# Altium project DPIAT202304_FRONTDOOR.PrjPcb
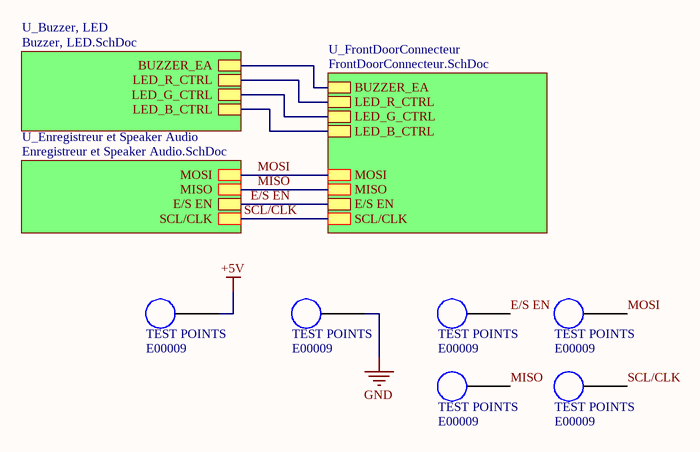
[diagram p0: Top-Sheet.SchDoc]
4 sheets, 53 parts. Net scope: hierarchical (ports join the sheet entries above them; power ports are global).
Board file: ADAM202303_FRONTDOOR.PcbDoc
Sheets:
  Top-Sheet.SchDoc
    U_FrontDoorConnecteur = FrontDoorConnecteur.SchDoc
    U_Buzzer, LED = Buzzer, LED.SchDoc
    U_Enregistreur et Speaker Audio = Enregistreur et Speaker Audio.SchDoc

## Sheet Top-Sheet.SchDoc
size Letter; Organization: Cegep Limoilou; Address1: 1300, 8e Avenue; Address2: Québec, QC; Address3: Canada; Address4: G1J 5L5; Revision: Enseignants; SheetNumber: 1; SheetTotal: 4; Conception: Ilyes Gharmoul; Titre: ADAM FRONT-DOOR SYST; Modification: Ilyes G

### Parts
T1  TEST POINTS  ADAM Inventory Number 1: E00009  [TEST POINTS]
T2  TEST POINTS  ADAM Inventory Number 1: E00009  [TEST POINTS]
T3  TEST POINTS  ADAM Inventory Number 1: E00009  [TEST POINTS]
T4  TEST POINTS  ADAM Inventory Number 1: E00009  [TEST POINTS]
T5  TEST POINTS  ADAM Inventory Number 1: E00009  [TEST POINTS]
T6  TEST POINTS  ADAM Inventory Number 1: E00009  [TEST POINTS]

### Sub-sheets
U_Buzzer, LED = Buzzer, LED.SchDoc: BUZZER_EA, LED_R_CTRL, LED_G_CTRL, LED_B_CTRL
U_Enregistreur et Speaker Audio = Enregistreur et Speaker Audio.SchDoc: MOSI, MISO, SCL/CLK, E/S EN
U_FrontDoorConnecteur = FrontDoorConnecteur.SchDoc: BUZZER_EA, LED_R_CTRL, LED_G_CTRL, LED_B_CTRL, MOSI, MISO, E/S EN, SCL/CLK

### Nets
+5V: T1.1
GND: T2.1
E/S EN: T3.1 ; sheet U_FrontDoorConnecteur/E/S EN, sheet U_Enregistreur et Speaker Audio/E/S EN
LED_B_CTRL: sheet U_FrontDoorConnecteur/LED_B_CTRL, sheet U_Buzzer, LED/LED_B_CTRL
LED_G_CTRL: sheet U_FrontDoorConnecteur/LED_G_CTRL, sheet U_Buzzer, LED/LED_G_CTRL
LED_R_CTRL: sheet U_FrontDoorConnecteur/LED_R_CTRL, sheet U_Buzzer, LED/LED_R_CTRL
MISO: T5.1 ; sheet U_FrontDoorConnecteur/MISO, sheet U_Enregistreur et Speaker Audio/MISO
MOSI: T4.1 ; sheet U_FrontDoorConnecteur/MOSI, sheet U_Enregistreur et Speaker Audio/MOSI
SCL/CLK: T6.1 ; sheet U_FrontDoorConnecteur/SCL/CLK, sheet U_Enregistreur et Speaker Audio/SCL/CLK
NetJ1_8: sheet U_FrontDoorConnecteur/BUZZER_EA, sheet U_Buzzer, LED/BUZZER_EA

### Notes on the sheet
- Titre :
- Conception :
- Date :
- Modification :
- Heure :
- Révision :
- Feuille
- de
- Fichier :

### Library data of the parts
T1-T6 = TEST POINTS: RCWCTE TEST POINTS; Manufacturer Part Number 1: RCWCTE

## Sheet FrontDoorConnecteur.SchDoc
size Letter; Organization: Cegep Limoilou; Address1: 1300, 8e Avenue; Address2: Québec, QC; Address3: Canada; Address4: G1J 5L5; Revision: Enseignants; SheetNumber: 2; SheetTotal: 4; Conception: Ilyes Gharmoul; Titre: Connecteur FrontDoor; Modification: Ilyes G
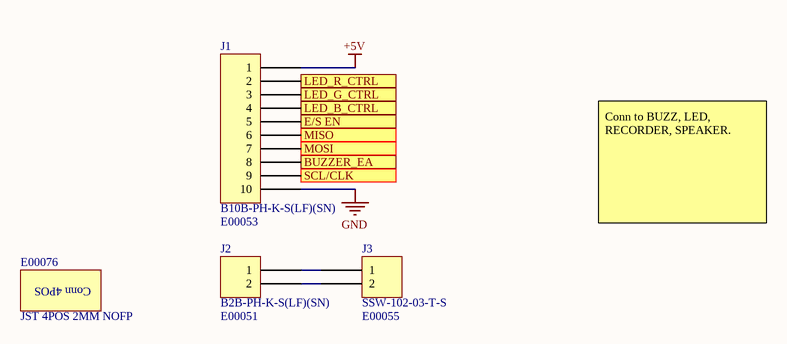
[diagram p1: FrontDoorConnecteur.SchDoc]

### Parts
H1  JST 4POS 2MM NOFP  ADAM Inventory Number 1: E00076
J1  B10B-PH-K-S(LF)(SN)  ADAM Inventory Number 1: E00053  [CONN JST 10PIN]
J2  B2B-PH-K-S(LF)(SN)  ADAM Inventory Number 1: E00051  [CONN JST 2PIN]
J3  SSW-102-03-T-S  ADAM Inventory Number 1: E00055  [CONN FEM HEADER 2PIN]

### Ports
BUZZER_EA, E/S EN, LED_B_CTRL, LED_G_CTRL, LED_R_CTRL, MISO, MOSI, SCL/CLK

### Nets
+5V: J1.1
GND: J1.10
E/S EN: J1.5 ; port E/S EN
LED_B_CTRL: J1.4 ; port LED_B_CTRL
LED_G_CTRL: J1.3 ; port LED_G_CTRL
LED_R_CTRL: J1.2 ; port LED_R_CTRL
MISO: J1.6 ; port MISO
MOSI: J1.7 ; port MOSI
SCL/CLK: J1.9 ; port SCL/CLK
NetJ1_8: J1.8 ; port BUZZER_EA
NetJ2_1: J2.1 J3.1
NetJ2_2: J2.2 J3.2

### Notes on the sheet
- Conn to BUZZ, LED, RECORDER, SPEAKER.
- Titre :
- Conception :
- Date :
- Modification :
- Heure :
- Révision :
- Feuille
- de
- Fichier :
- (in symbol CONN JST 4POS 2MM NOFP) Conn 4POS

### Library data of the parts
H1 = CONN JST 4POS 2MM NOFP: No footprint, for BOM; Manufacturer Part Number 1: 0022272041; Supplier 1: Mouser; Supplier Part Number 1: 538-22-27-2041
J1 = CONN JST 10POS TH: CONN HEADER VERT 10POS 2MM; Manufacturer: JST Sales America Inc.; Contact Length - Mating: 0.130" (3.30mm); Contact Length - Post: 0.134" (3.40mm); Current Rating (Amps): 2A; Material Flammability Rating: UL94 V-0; Number of Positions: 10; Number of Positions Loaded: All; Overall Contact Length: 0.333" (8.45mm); Pitch - Mating: 0.079" (2.00mm); Shrouding: Shrouded - 4 Wall; Style: Board to Cable/Wire; Voltage Rating: 100V; Manufacturer Part Number 1: B10B-PH-K-S(LF)(SN); ComponentLink1Description: Datasheet; ComponentLink1URL: http://www.jst-mfg.com/product/pdf/eng/ePH.pdf; ComponentLink2Description: DigiKey Link; ComponentLink2URL: http://digikey.com/product-detail/en/jst-sales-america-inc/B10B-PH-K-S-LF-SN/455-1712-ND/926619; Connector Type: Header; Contact Finish - Mating: Tin; Contact Finish - Post: Tin; Contact Material: Brass; Contact Shape: Square; Contact Type: Male Pin; Fastening Type: Detent Lock; Insulation Color: Natural; Insulation Height: 0.236" (6.00mm); Insulation Material: Polyamide (PA66), Nylon 6/6; LastUpdated: 2020-01-12 22:31:09; Lifecycle Status: Active; Minimum Order: 1; Mounting Type: Through Hole; Number of Rows: 1; Operating Temperature: -25°C ~ 85°C; Packaging: Bulk; PartId: 33; Part Status: Active; Price: 0.46; Series: PH; Supplier 1: DigiKey; Supplier Part Number 1: 455-1712-ND; Termination: Press-Fit, Solder
J2 = CONN JST 2PIN TH: CONN HEADER VERT 2POS 2MM; Manufacturer: JST Sales America Inc.; Contact Length - Mating: 0.130" (3.30mm); Contact Length - Post: 0.134" (3.40mm); Current Rating (Amps): 2A; Material Flammability Rating: UL94 V-0; Number of Positions: 2; Number of Positions Loaded: All; Overall Contact Length: 0.333" (8.45mm); Pitch - Mating: 0.079" (2.00mm); Shrouding: Shrouded - 4 Wall; Style: Board to Cable/Wire; Voltage Rating: 100V; Manufacturer Part Number 1: B2B-PH-K-S(LF)(SN); ComponentLink1Description: Datasheet; ComponentLink1URL: http://www.jst-mfg.com/product/pdf/eng/ePH.pdf; ComponentLink2Description: DigiKey Link; ComponentLink2URL: http://digikey.com/product-detail/en/jst-sales-america-inc/B2B-PH-K-S-LF-SN/455-1704-ND/926611; Connector Type: Header; Contact Finish - Mating: Tin; Contact Finish - Post: Tin; Contact Material: Brass; Contact Shape: Square; Contact Type: Male Pin; Fastening Type: Detent Lock; Insulation Color: Natural; Insulation Height: 0.236" (6.00mm); Insulation Material: Polyamide (PA66), Nylon 6/6; LastUpdated: 2020-01-03 23:40:58; Lifecycle Status: Active; Minimum Order: 1; Mounting Type: Through Hole; Number of Rows: 1; Operating Temperature: -25°C ~ 85°C; Packaging: Bulk; PartId: 11; Part Status: Active; Price: 0.17; Series: PH; Supplier 1: DigiKey; Supplier Part Number 1: 455-1704-ND; Termination: Press-Fit, Solder
J3 = CONN FEM HEADER 2POS: CONN RCPT 2POS 0.1 TIN; Manufacturer: Samtec Inc.; Connector Type: Receptacle; Current Rating (Amps): 5.7A per Contact; Material Flammability Rating: UL94 V-0; Number of Positions: 2; Number of Positions Loaded: All; Style: Board to Board or Cable; Manufacturer Part Number 1: SSW-102-03-T-S; ComponentLink2Description: DigiKey Link; ComponentLink2URL: http://digikey.com/product-detail/en/samtec-inc/SSW-102-03-T-S/SSW-102-03-T-S-ND/7873010; Contact Finish - Mating: Tin; Contact Finish - Post: Tin; Contact Type: Forked; Fastening Type: Push-Pull; Insulation Color: Black; LastUpdated: 2022-06-21 15:06:02; Lifecycle Status: Active; Minimum Order: 1; Mounting Type: Through Hole; Number of Rows: 1; Operating Temperature: -55°C ~ 105°C; Packaging: Bulk; Part Status: Active; Price: 0.53; Series: SSW; Supplier 1: DigiKey; Supplier Part Number 1: SSW-102-03-T-S-ND; Termination: Solder

## Sheet Buzzer, LED.SchDoc
size Letter; Organization: Cegep Limoilou; Address1: 1300, 8e Avenue; Address2: Québec, QC; Address3: Canada; Address4: G1J 5L5; Revision: Enseignants; SheetNumber: 3; SheetTotal: 4; Conception: Ilyes Gharmoul; Titre: Buzzer LED Conn; Modification: Ilyes G
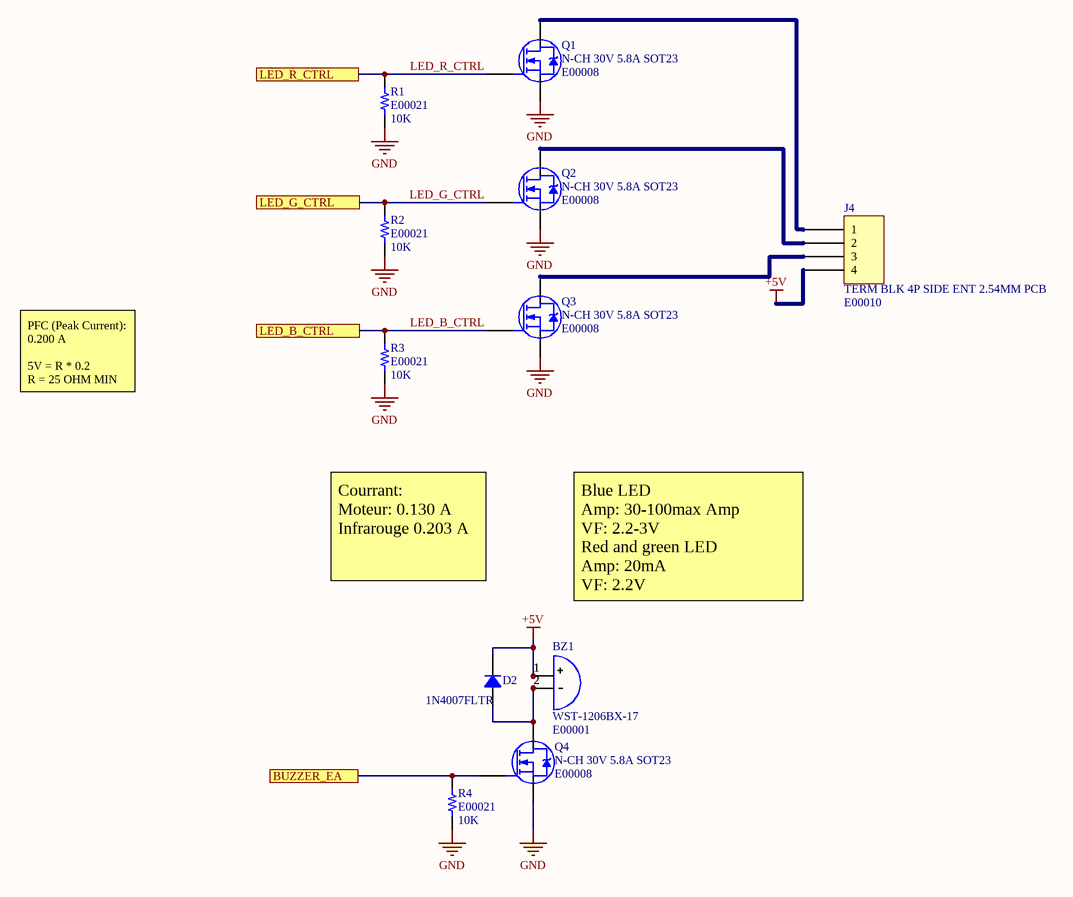
[diagram p2: Buzzer, LED.SchDoc]

### Parts
BZ1  WST-1206BX-17  ADAM Inventory Number 1: E00001  [BUZZ WST-1206BX]
D2  1N4007FLTR  [SOD123F]
J4  TERM BLK 4P SIDE ENT 2.54MM PCB  ADAM Inventory Number 1: E00010  [TERM BLOC 4P]
Q1  N-CH 30V 5.8A SOT23  ADAM Inventory Number 1: E00008  [N-CHANNEL TRANS]
Q2  N-CH 30V 5.8A SOT23  ADAM Inventory Number 1: E00008  [N-CHANNEL TRANS]
Q3  N-CH 30V 5.8A SOT23  ADAM Inventory Number 1: E00008  [N-CHANNEL TRANS]
Q4  N-CH 30V 5.8A SOT23  ADAM Inventory Number 1: E00008  [N-CHANNEL TRANS]
R1  ADAM Inventory Number 1: E00021  [RES 0603]  (hidden comment: 10K)
R2  ADAM Inventory Number 1: E00021  [RES 0603]  (hidden comment: 10K)
R3  ADAM Inventory Number 1: E00021  [RES 0603]  (hidden comment: 10K)
R4  ADAM Inventory Number 1: E00021  [RES 0603]  (hidden comment: 10K)

### Ports
BUZZER_EA, LED_B_CTRL, LED_G_CTRL, LED_R_CTRL

### Nets
+5V: BZ1.1 D2.2 J4.4
GND: Q1.2(S) Q2.2(S) Q3.2(S) Q4.2(S) R1.1 R2.1 R3.1 R4.1
LED_B_CTRL: Q3.1(G) R3.2 ; port LED_B_CTRL
LED_G_CTRL: Q2.1(G) R2.2 ; port LED_G_CTRL
LED_R_CTRL: Q1.1(G) R1.2 ; port LED_R_CTRL
NetBZ1_2: BZ1.2 D2.1 Q4.3(D)
NetJ1_8: Q4.1(G) R4.2 ; port BUZZER_EA
NetJ4_1: J4.1 Q1.3(D)
NetJ4_2: J4.2 Q2.3(D)
NetJ4_3: J4.3 Q3.3(D)

### Notes on the sheet
- PFC (Peak Current): 0.200 A
  5V = R * 0.2
  R = 25 OHM MIN
- Courrant:
  Moteur: 0.130 A
  Infrarouge 0.203 A
- Blue LED
  Amp: 30-100max Amp
  VF: 2.2-3V
  Red and green LED
  Amp: 20mA
  VF: 2.2V
- Titre :
- Conception :
- Date :
- Modification :
- Heure :
- Révision :
- Feuille
- de
- Fichier :

### Library data of the parts
BZ1 = WST-1206BX-17: Buzzers Indicator, Internally Driven Magnetic 5 V 30mA 3.1kHz 83dB @ 5V, 10cm Through Hole PC Pins; Supplier 1: Digi-Key; Manufacturer Part Number 1: WST-1206BX-17; Supplier Part Number 1: 433-1081-ND
D2 = 1N4007FLTR: STANDARD RECTIFIER 1000V SOD-123; Manufacturer: SMC Diode Solutions; Capacitance @ Vr, F: 15pF @ 4V, 1MHz; Current - Average Rectified (Io): 1A; Current - Reverse Leakage @ Vr: 5µA @ 1000V; Speed: Standard Recovery >500ns, > 200mA (Io); Voltage - Forward (Vf) (Max) @ If: 1.1V @ 1A; Manufacturer Part Number 1: 1N4007FLTR; ComponentLink1Description: Datasheet; ComponentLink1URL: http://www.smc-diodes.com/propdf/1N4001FL-1N4007FL%20N1646%20REV.A.pdf; ComponentLink2Description: DigiKey Link; ComponentLink2URL: http://digikey.com/product-detail/en/smc-diode-solutions/1N4007FLTR/1655-1N4007FLCT-ND/11657827; Diode Type: Standard; LastUpdated: 2020-08-30 20:59:55; Lifecycle Status: Active; Minimum Order: 1; Mounting Type: Surface Mount; Package / Case: SOD-123F; Packaging: TapeAndReel; PartId: 3314; Price: 0.01; Supplier 1: DigiKey; Supplier Part Number 1: 1655-1N4007FLCT-ND; Supplier Device Package: SOD-123FL; Voltage - DC Reverse (Vr) (Max): 1000V
J4 = TERM BLK 4P SIDE ENT 2.54MM PCB: Manufacturer Part Number 1: 282834-4; Manufacturer: TE Connectivity AMP Connectors; Current: 10A; Mating Orientation: Horizontal with Board; Number of Levels: 1; Pitch: 0.100" (2.54mm); Positions Per Level: 4; Voltage: 150V; Wire Gauge: 16-30 AWG; Wire Termination: Screw - Rising Cage Clamp; Color: Green; ComponentLink1Description: Datasheet; ComponentLink1URL: https://www.te.com/commerce/DocumentDelivery/DDEController?Action=srchrtrv&DocNm=282834&DocType=Customer+Drawing&DocLang=English; ComponentLink2Description: DigiKey Link; ComponentLink2URL: http://digikey.com/product-detail/en/te-connectivity-amp-connectors/282834-4/A98335-ND/1153265; LastUpdated: 2020-01-15 04:16:05; Lifecycle Status: Active; Minimum Order: 1; Mounting Type: Through Hole; Packaging: Bulk; Part Status: Active; Price: 2.68; Series: Buchanan; Supplier 1: DigiKey; Supplier Part Number 1: A98335-ND
Q1-Q4 = TRANS N-CHANNEL 30V 5.8A SOT23: N-Channel 5.8A (Tj) 350mW Surface Mount SOT-23; Manufacturer: MCC; Manufacturer Part Number 1: SI3404-TP; Source: IC_Component.SchLib; Design Item ID: TRANS N-CHANNEL 30V 5.8A SOT23; Component Type: Transistors; Supplier 1: Digi-Key; Supplier Part Number 1: DMN3051LDICT-ND
R1-R4 = RES SMD 10K OHM: RES SMD 10K OHM 1% 1/10W 0603; Manufacturer Part Number 1: RC0603FR-0710KL; Manufacturer: Rohm Semiconductor; Power (Watts): 0.25W, 1/4W; Temperature Coefficient: ±100ppm/°C; ComponentLink1Description: Datasheet; ComponentLink1URL: https://www.rohm.com/datasheet/ESR01MZPF/esr-e; ComponentLink2Description: DigiKey Link; ComponentLink2URL: https://www.digikey.com/en/products/detail/rohm-semiconductor/ESR03EZPF1002/1983429; Composition: Thick Film; Device Package: 0603 (1608 Metric); Features: Automotive AEC-Q200, Pulse Withstanding; Height - Seated (Max): 0.022" (0.55mm); LastUpdated: 2023-03-27 19:26:49; Lifecycle Status: Active; Minimum Order: 1; Number of Terminations: 2; Operating Temperature: -55°C ~ 155°C; Package / Case: 0603 (1608 Metric); Packaging: TapeAndReel; PartId: 5466; Part Status: Active; Price: 0.02; Ratings: AEC-Q200; Resistance: 10K; Series: ESR; Size / Dimension: 0.063" L x 0.031" W (1.60mm x 0.80mm); Supplier Device Package: 0603; Tolerance: ±1%; Supplier 1: Future Electronics; Supplier Part Number 1: 3349388; Value: 10K

## Sheet Enregistreur et Speaker Audio.SchDoc
size Letter; Organization: Cegep Limoilou; Address1: 1300, 8e Avenue; Address2: Québec, QC; Address3: Canada; Address4: G1J 5L5; Revision: Enseignants; SheetNumber: 4; SheetTotal: 4; Conception: Ilyes Gharmoul; Titre: Enregistreur et Speaker; Modification: Ilyes G
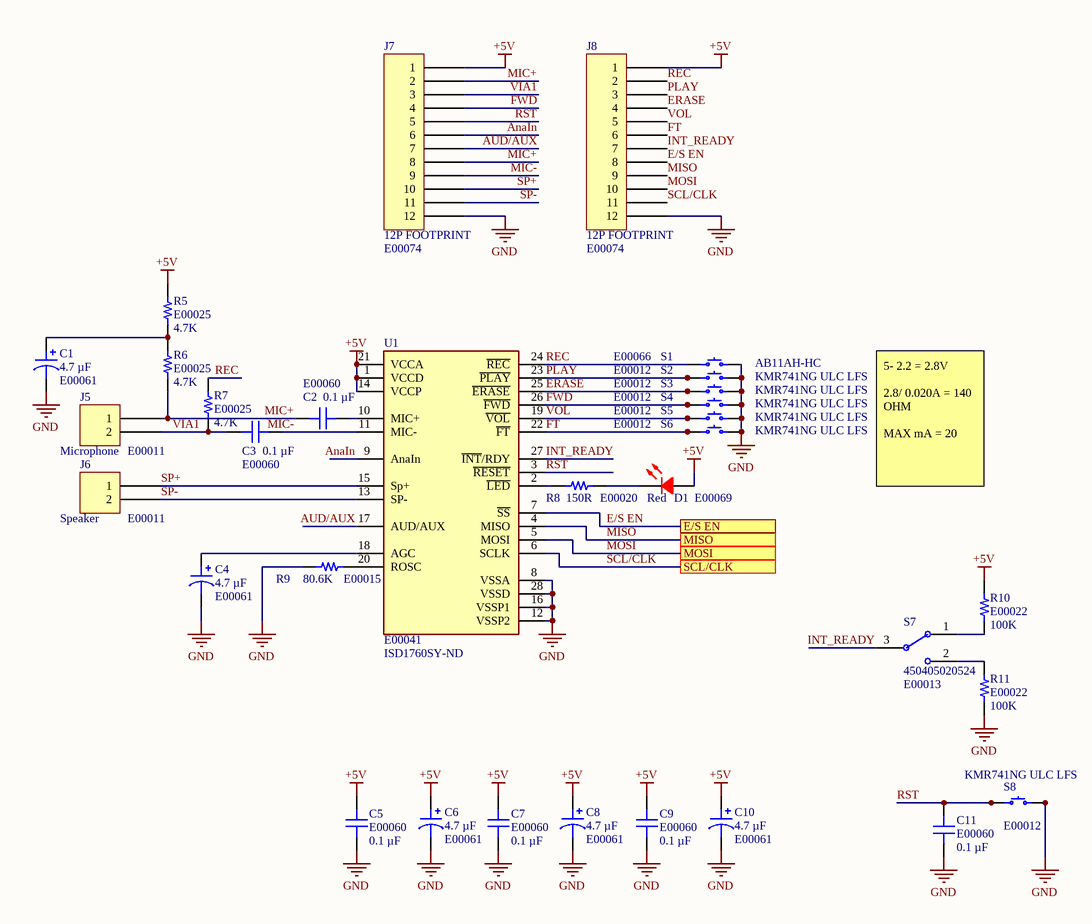
[diagram p3: Enregistreur et Speaker Audio.SchDoc]

### Parts
C1  4.7 µF  ADAM Inventory Number 1: E00061  [CAP ALUM 4.3MM2]
C2  ADAM Inventory Number 1: E00060  [CAP 0603]  (hidden comment: 0.1 µF)
C3  ADAM Inventory Number 1: E00060  [CAP 0603]  (hidden comment: 0.1 µF)
C4  4.7 µF  ADAM Inventory Number 1: E00061  [CAP ALUM 4.3MM2]
C5  ADAM Inventory Number 1: E00060  [CAP 0603]  (hidden comment: 0.1 µF)
C6  4.7 µF  ADAM Inventory Number 1: E00061  [CAP ALUM 4.3MM2]
C7  ADAM Inventory Number 1: E00060  [CAP 0603]  (hidden comment: 0.1 µF)
C8  4.7 µF  ADAM Inventory Number 1: E00061  [CAP ALUM 4.3MM2]
C9  ADAM Inventory Number 1: E00060  [CAP 0603]  (hidden comment: 0.1 µF)
C10  4.7 µF  ADAM Inventory Number 1: E00061  [CAP ALUM 4.3MM2]
C11  ADAM Inventory Number 1: E00060  [CAP 0603]  (hidden comment: 0.1 µF)
D1  Red  ADAM Inventory Number 1: E00069  [Red Led 0603]
J5  Microphone  ADAM Inventory Number 1: E00011  [TERM BLOC 2P]
J6  Speaker  ADAM Inventory Number 1: E00011  [TERM BLOC 2P]
J7  12P FOOTPRINT  ADAM Inventory Number 1: E00074  [CONN 12PIN FEMALE]
J8  12P FOOTPRINT  ADAM Inventory Number 1: E00074  [CONN 12PIN FEMALE]
R5  ADAM Inventory Number 1: E00025  [RES 0603]  (hidden comment: 4.7K)
R6  ADAM Inventory Number 1: E00025  [RES 0603]  (hidden comment: 4.7K)
R7  ADAM Inventory Number 1: E00025  [RES 0603]  (hidden comment: 4.7K)
R8  ADAM Inventory Number 1: E00020  [RES 0603]  (hidden comment: 150R)
R9  ADAM Inventory Number 1: E00015  [RES 0603]  (hidden comment: 80.6K)
R10  ADAM Inventory Number 1: E00022  [RES 0603]  (hidden comment: 100K)
R11  ADAM Inventory Number 1: E00022  [RES 0603]  (hidden comment: 100K)
S1  AB11AH-HC  ADAM Inventory Number 1: E00066  [BUTTON AB11AH-HC]
S2  KMR741NG ULC LFS  ADAM Inventory Number 1: E00012  [Switch Lin SMD]
S3  KMR741NG ULC LFS  ADAM Inventory Number 1: E00012  [Switch Lin SMD]
S4  KMR741NG ULC LFS  ADAM Inventory Number 1: E00012  [Switch Lin SMD]
S5  KMR741NG ULC LFS  ADAM Inventory Number 1: E00012  [Switch Lin SMD]
S6  KMR741NG ULC LFS  ADAM Inventory Number 1: E00012  [Switch Lin SMD]
S7  450405020524  ADAM Inventory Number 1: E00013  [SL 3Pos Switch]
S8  KMR741NG ULC LFS  ADAM Inventory Number 1: E00012  [Switch Lin SMD]
U1  ADAM Inventory Number 1: E00041  Supplier Part Number 1: ISD1760SY-ND  [ISD1760SY]  (hidden comment: ISD1760SY)

### Ports
E/S EN, MISO, MOSI, SCL/CLK

### Nets
+5V: C5.2 C6.1 C7.2 C8.1 C9.2 C10.1 D1.1 J7.1 J8.1 R5.2 R10.2 U1.1(VCCD) U1.14(VCCP) U1.21(VCCA)
GND: C1.2 C4.2 C5.1 C6.2 C7.1 C8.2 C9.1 C10.2 C11.1 J7.12 J8.12 R9.1 R11.1 S1.2 S2.3 S2.4 S3.3 S3.4 S4.3 S4.4 S5.3 S5.4 S6.3 S6.4 S8.3 S8.4 U1.8(VSSA) U1.12(VSSP2) U1.16(VSSP1) U1.28(VSSD)
AnaIn: J7.6 U1.9(AnaIn)
AUD/AUX: J7.7 U1.17(AUD/AUX)
E/S EN: J8.8 U1.7(~{SS}) ; port E/S EN
ERASE: J8.4 S3.1 S3.2 U1.25(~{ERASE})
FT: J8.6 S6.1 S6.2 U1.22(~{FT})
FWD: J7.4 S4.1 S4.2 U1.26(~{FWD})
INT_READY: J8.7 S7.3(COM) U1.27(~{INT}/RDY)
MIC+: C2.2 J5.1 J7.2 J7.8 R6.1
MIC-: C3.1 J7.9 U1.11(MIC-)
MISO: J8.9 U1.4(MISO) ; port MISO
MOSI: J8.10 U1.5(MOSI) ; port MOSI
PLAY: J8.3 S2.1 S2.2 U1.23(~{PLAY})
REC: J8.2 R7.2 S1.1 U1.24(~{REC})
RST: C11.2 J7.5 S8.1 S8.2 U1.3(~{RESET})
SCL/CLK: J8.11 U1.6(SCLK) ; port SCL/CLK
SP+: J6.1 J7.10 U1.15(Sp+)
SP-: J6.2 J7.11 U1.13(SP-)
VIA1: C3.2 J5.2 J7.3 R7.1
VOL: J8.5 S5.1 S5.2 U1.19(~{VOL})
NetC1_1: C1.1 R5.1 R6.2
NetC2_1: C2.1 U1.10(MIC+)
NetC4_1: C4.1 U1.18(AGC)
NetD1_2: D1.2 R8.2
NetR8_1: R8.1 U1.2(~{LED})
NetR9_2: R9.2 U1.20(ROSC)
NetR10_1: R10.1 S7.1
NetR11_2: R11.2 S7.2

### Notes on the sheet
- 5- 2.2 = 2.8V
  2.8/ 0.020A = 140 OHM
  MAX mA = 20
- Titre :
- Conception :
- Date :
- Modification :
- Heure :
- Révision :
- Feuille
- de
- Fichier :

### Library data of the parts
C1 C4 C6 C8 C10 = CAP ALUM 4.7UF 20% 35V: CAP ALUM 4.7UF 20% 35V SMD; manufacturer: United Chemi-Con; Manufacturer Part Number 1: EMVE350ADA4R7MD55G; Lifetime @ Temp.: 1000 Hrs @ 105°C; Polarization: Polar; Ripple Current @ Low Frequency: 16 mA @ 120 Hz; Surface Mount Land Size: 0.169" L x 0.169" W (4.30mm x 4.30mm); Applications: General Purpose; Capacitance: 4.7 µF; componentlink1description: Datasheet; componentlink1url: //media.digikey.com/pdf/Data%20Sheets/United%20Chemi-Con%20PDFs/MVE%20Series.pdf; componentlink2description: DigiKey Link; componentlink2url: https://www.digikey.com/en/products/detail/united-chemi-con/EMVE350ADA4R7MD55G/756875; Device Package: Radial, Can - SMD; Height - Seated (Max): 0.205" (5.20mm); lastupdated: 2023-04-04 19:53:03; Lifecycle Status: Active; Minimum Order: 1; Mounting Type: Surface Mount; Operating Temperature: -40°C ~ 105°C; Package / Case: Radial, Can - SMD; packaging: TapeAndReel; partid: 7039; Part Status: Active; price: 0.06; series: Alchip™- MVE; Size / Dimension: 0.157" Dia (4.00mm); Tolerance: ±20%; Voltage - Rated: 35 V; Supplier 1: Mouser; Supplier Part Number 1: 661-EMVE350ADA4R7MD5; value: 4.7 µF
C2 C3 C5 C7 C9 C11 = CAP CER 0.1UF 50V X7R 0603: Manufacturer Part Number 1: C0603C104K5RAC7411; manufacturer: KEMET; Tolerance: ±10%; Applications: Bypass, Decoupling; Capacitance: 0.1 µF; componentlink1description: Datasheet; componentlink1url: https://api.kemet.com/component-edge/download/datasheet/C0603C104K5RAC7411.pdf; componentlink2description: DigiKey Link; componentlink2url: https://www.digikey.com/en/products/detail/kemet/C0603C104K5RAC7411/3317013; Device Package: 0603 (1608 Metric); lastupdated: 2023-03-28 19:09:05; Lifecycle Status: Active; Minimum Order: 1; Mounting Type: Surface Mount, MLCC; Operating Temperature: -55°C ~ 125°C; Package / Case: 0603 (1608 Metric); packaging: TapeAndReel; partid: 2233; Part Status: Active; price: 0.01; series: SMD Comm X7R; Size / Dimension: 0.063" L x 0.031" W (1.60mm x 0.80mm); Supplier 1: DigiKey; Supplier Part Number 1: 399-C0603C104K5RAC7411CT-ND; Temperature Coefficient: X7R; Thickness (Max): 0.035" (0.90mm); Voltage - Rated: 50V; Value: 0.1 µF
D1 = 0603 RED LED: Manufacturer Part Number 1: BL-HUB36A-AV-TRB; Manufacturer: American Bright Optoelectronics Corporation; Configuration: Standard; Current - Test: 20mA; Lens Color: Colorless; Lens Style: Rectangle with Flat Top; Lens Transparency: Clear; Millicandela Rating: 94mcd; Viewing Angle: 120°; Voltage - Forward (Vf) (Typ): 2.2V; Wavelength - Dominant: 632nm; Wavelength - Peak: 645nm; Color: Red; ComponentLink1Description: Datasheet; ComponentLink1URL: https://americanbrightled.com/pdffiles/smt/BL-HUB36A-AV-TRB.pdf; ComponentLink2Description: DigiKey Link; ComponentLink2URL: https://www.digikey.com/en/products/detail/american-bright-optoelectronics-corporation/BL-HUB36A-AV-TRB/9678174; Device Package: 0603 (1608 Metric); Height (Max): 0.70mm; LastUpdated: 2023-03-27 19:53:19; Lifecycle Status: Active; Minimum Order: 1; Mounting Type: Surface Mount; Package / Case: 0603 (1608 Metric); Packaging: TapeAndReel; PartId: 1020; Part Status: Active; Price: 0.04; Series: -; Size / Dimension: 1.60mm L x 0.80mm W; Supplier 1: DigiKey; Supplier Part Number 1: BL-HUB36A-AV-TRBCT-ND; Supplier Device Package: 0603; Value: Red
J5 J6 = TERM BLK 2P SIDE ENT 2.54MM PCB: Manufacturer Part Number 1: 282834-2; Manufacturer: TE Connectivity AMP Connectors; Current: 10A; Mating Orientation: Horizontal with Board; Number of Levels: 1; Pitch: 0.100" (2.54mm); Positions Per Level: 2; Voltage: 150V; Wire Gauge: 16-30 AWG; Wire Termination: Screw - Rising Cage Clamp; Color: Green; ComponentLink1Description: Datasheet; ComponentLink1URL: https://www.te.com/commerce/DocumentDelivery/DDEController?Action=srchrtrv&DocNm=282834&DocType=Customer+Drawing&DocLang=English; ComponentLink2Description: DigiKey Link; ComponentLink2URL: http://digikey.com/product-detail/en/te-connectivity-amp-connectors/282834-2/A98333-ND/1150135; LastUpdated: 2020-01-15 04:15:38; Lifecycle Status: Active; Minimum Order: 1; Mounting Type: Through Hole; Packaging: Bulk; Part Status: Active; Price: 0.88; Series: Buchanan; Supplier 1: DigiKey; Supplier Part Number 1: A98333-ND
J7 J8 = 12P FOOTPRINT: FOOTPRINT FOR TEST OR JUST IN CASE; Manufacturer: Harwin Inc.; Manufacturer Part Number 1: PPTC121LFBN-RC; Connector Type: Receptacle; Current Rating (Amps): 3A; Mated Stacking Heights: 11.04mm, 12.63mm; Material Flammability Rating: UL94 V-0; Number of Positions: 12; Number of Positions Loaded: All; Style: Board to Board or Cable; ComponentLink1Description: Datasheet; ComponentLink1URL: https://cdn.harwin.com/pdfs/C001XX_M20_Series_Connectors.pdf; ComponentLink2Description: DigiKey Link; ComponentLink2URL: http://digikey.com/product-detail/en/harwin-inc/M20-7821242/952-1852-ND/3727819; Contact Finish - Mating: Gold; Contact Finish - Post: Tin; Contact Finish Thickness - Mating: Flash; Contact Type: Female Socket; Fastening Type: Push-Pull; Insulation Color: Black; LastUpdated: 2022-09-21 18:59:31; Lifecycle Status: Active; Minimum Order: 5004; Mounting Type: Through Hole; Number of Rows: 1; Operating Temperature: -40°C ~ 105°C; Packaging: Tube; Part Status: Active; Price: 0.74; Series: M20; Termination: Solder; Supplier 1: Digi-Key; Supplier Part Number 1: S6100-ND
R5-R7 = RES SMD 4.7K OHM: RES 4.7K OHM 1% 1/10W 0603; Manufacturer Part Number 1: RC0603FR-074K7L; Manufacturer: Stackpole Electronics Inc; Power (Watts): 0.1W, 1/10W; Temperature Coefficient: ±100ppm/°C; ComponentLink1Description: Datasheet; ComponentLink1URL: https://www.seielect.com/catalog/sei-rmcf_rmcp.pdf; ComponentLink2Description: DigiKey Link; ComponentLink2URL: https://www.digikey.com/en/products/detail/stackpole-electronics-inc/RMCF0603FT4K70/1760998; Composition: Thick Film; Device Package: 0603 (1608 Metric); Features: Automotive AEC-Q200; Height - Seated (Max): 0.022" (0.55mm); LastUpdated: 2023-04-04 19:29:43; Lifecycle Status: Active; Minimum Order: 1; Number of Terminations: 2; Operating Temperature: -55°C ~ 155°C; Package / Case: 0603 (1608 Metric); Packaging: CutTape; PartId: 6078; Part Status: Active; Price: 0.01; Ratings: AEC-Q200; Resistance: 4.7K; Series: RMCF; Size / Dimension: 0.061" L x 0.031" W (1.55mm x 0.80mm); Supplier Device Package: 0603; Tolerance: ±1%; Supplier 1: Digi-Key; Supplier Part Number 1: 311-4.70KHRCT-ND; Value: 4.7K
R8 = RES SMD 150 OHM: RES SMD 150 OHM 0.1% 1/8W 0603; Manufacturer Part Number 1: RC0603FR-07150RL; Manufacturer: Vishay Beyschlag; Power (Watts): 0.125W, 1/8W; Temperature Coefficient: ±25ppm/°C; ComponentLink1Description: Datasheet; ComponentLink1URL: http://www.vishay.com/docs/28785/mcat_pre.pdf; ComponentLink2Description: DigiKey Link; ComponentLink2URL: http://digikey.com/product-detail/en/vishay-beyschlag/MCT0603MD1500BP100/MCT0603-150-MBCT-ND/2092134; Composition: Thin Film; Device Package: 0603 (1608 Metric); Features: Anti-Sulfur, Automotive AEC-Q200; Height - Seated (Max): 0.022" (0.55mm); LastUpdated: 2023-04-04 19:29:46; Lifecycle Status: Active; Minimum Order: 1; Number of Terminations: 2; Operating Temperature: -55°C ~ 155°C; Package / Case: 0603 (1608 Metric); Packaging: TapeAndReel; PartId: 5246; Part Status: Active; Price: 0.23; Ratings: AEC-Q200; Resistance: 150R; Series: MCT AT - Precision; Size / Dimension: 0.061" L x 0.033" W (1.55mm x 0.85mm); Supplier Device Package: 0603; Tolerance: ±0.1%; Supplier 1: Future Electronics; Supplier Part Number 1: 1201284; Value: 150R
R9 = RES SMD 80.6K OHM: RES SMD 80.6K OHM 1% 1/4W 0603; Manufacturer Part Number 1: ERJ-3EKF8062V; Manufacturer: Vishay Dale; Power (Watts): 0.25W, 1/4W; Temperature Coefficient: ±100ppm/°C; ComponentLink1Description: Datasheet; ComponentLink1URL: https://www.vishay.com/docs/20065/rcse3.pdf; ComponentLink2Description: DigiKey Link; ComponentLink2URL: https://www.digikey.com/en/products/detail/vishay-dale/RCS060380K6FKEA/5868691; Composition: Thick Film; Device Package: 0603 (1608 Metric); Features: Automotive AEC-Q200, Pulse Withstanding; Height - Seated (Max): 0.020" (0.50mm); LastUpdated: 2023-04-04 19:27:58; Lifecycle Status: Active; Minimum Order: 1; Number of Terminations: 2; Operating Temperature: -55°C ~ 155°C; Package / Case: 0603 (1608 Metric); Packaging: TapeAndReel; PartId: 62631; Part Status: Active; Price: 0.02; Ratings: AEC-Q200; Resistance: 80.6K; Series: RCS e3; Size / Dimension: 0.061" L x 0.033" W (1.55mm x 0.85mm); Supplier Device Package: 0603; Tolerance: ±1%; Supplier 1: Newark; Supplier Part Number 1: 63W0948; Value: 80.6K
R10 R11 = RES SMD 100K OHM: RES SMD 100K OHM 1% 1/4W 0603; Manufacturer Part Number 1: RC0603FR-07100KL; Manufacturer: Vishay Dale; Power (Watts): 0.25W, 1/4W; Temperature Coefficient: ±100ppm/°C; ComponentLink1Description: Datasheet; ComponentLink1URL: http://www.vishay.com/docs/20065/rcse3.pdf; ComponentLink2Description: DigiKey Link; ComponentLink2URL: https://www.digikey.com/en/products/detail/vishay-dale/RCS0603100KFKEA/5866946; Composition: Thick Film; Device Package: 0603 (1608 Metric); Features: Automotive AEC-Q200, Pulse Withstanding; Height - Seated (Max): 0.020" (0.50mm); LastUpdated: 2023-03-27 19:26:49; Lifecycle Status: Active; Minimum Order: 1; Number of Terminations: 2; Operating Temperature: -55°C ~ 155°C; Package / Case: 0603 (1608 Metric); Packaging: TapeAndReel; PartId: 5363; Part Status: Active; Price: 0.02; Ratings: AEC-Q200; Resistance: 100K; Series: RCS e3; Size / Dimension: 0.061" L x 0.033" W (1.55mm x 0.85mm); Supplier Device Package: 0603; Tolerance: ±1%; Supplier 1: Future Electronics; Supplier Part Number 1: 3697448; Value: 100K
S1 = AB11AH-HC: SWITCH PUSH SPST-NO 0.4VA 28V; Manufacturer: NKK Switches; Actuator Type: Round, Button; Color - Actuator/Cap: Red; Current Rating (Amps): 0.4VA (AC/DC); Switch Function: Off-Mom; Manufacturer Part Number 1: AB11AH-HC; Circuit: SPST-NO; ComponentLink1Description: Datasheet; ComponentLink1URL: https://www.nkkswitches.com/pdf/Apushbuttons.pdf; ComponentLink2Description: DigiKey Link; ComponentLink2URL: http://digikey.com/product-detail/en/nkk-switches/AB11AH-HC/360-2604-ND/1056046; Features: Sealed - Fully; LastUpdated: 2020-01-25 20:05:42; Lifecycle Status: Active; Minimum Order: 1; Mounting Type: Through Hole, Right Angle; Operating Temperature: -30°C ~ 85°C; Packaging: Tray; Part Status: Active; Price: 5.00; Series: AB; Supplier 1: DigiKey; Supplier Part Number 1: 360-2604-ND; Termination Style: PC Pin; Type: Standard; Voltage Rating - AC: 28V; Voltage Rating - DC: 28V
S2-S6 S8 = Sw Lin: SWITCH TACTILE SPST-NO 50MA 32V; Manufacturer: C&K; Actuator Height off PCB, Vertical: 2.50mm; Actuator Orientation: Top Actuated; Actuator Type: Standard; Contact Rating @ Voltage: 0.05A @ 32VDC; Illumination: Non-Illuminated; Ingress Protection: IP67 - Dust Tight, Waterproof; Operating Force: 400gf; Outline: 4.20mm x 2.80mm; Switch Function: Off-Mom; Manufacturer Part Number 1: KMR741NG ULC LFS; Circuit: SPST-NO; ComponentLink1Description: Datasheet; ComponentLink1URL: https://dznh3ojzb2azq.cloudfront.net/products/Tactile/KMR7/documents/datasheet.pdf; ComponentLink2Description: DigiKey Link; ComponentLink2URL: http://digikey.com/product-detail/en/c-k/KMR741NG-ULC-LFS/CKN10688CT-ND/6035360; LastUpdated: 2020-04-09 10:01:05; Lifecycle Status: Active; Minimum Order: 1; Mounting Type: Surface Mount; Operating Temperature: -40°C ~ 85°C; Packaging: TapeAndReel; Part Status: Active; Price: 0.16; Series: KMR7; Supplier 1: DigiKey; Supplier Part Number 1: CKN10688CT-ND; Termination Style: Gull Wing
S7 = SLIDE SWIT: SMT 8.7 X 3.0 MM MINI SLIDE SWIT; Manufacturer: Würth Elektronik; Rated Current: 300mA; Rated Voltage: 5VDC; Switching Function: On-On; Circuit: SPDT; Actuator Length: 2.00mm; Actuator Type: Standard; Contact Timing: Non-Shorting (BBM); Current Rating (Amps): 300mA (DC); Voltage Rating - DC: 5 V; ComponentLink1Description: Datasheet; ComponentLink1URL: https://www.we-online.com/catalog/datasheet/450405020524.pdf; ComponentLink2Description: DigiKey Link; ComponentLink2URL: https://www.digikey.com/en/products/detail/würth-elektronik/450405020524/11627297; Packaging: TapeAndReel; Publisher: Wurth Elektronik; Contact Material: Copper Alloy; Mounting Technology: SMT; Operating Temperature: -40°C ~ 85°C; Contact Plating: Silver; Manufacturer Part Number 1: 450405020524; Published Date: November 2019; Terminal Material: Copper Alloy; Size: 8.7x3mm; Terminal Plating: Silver; Contact Finish: Silver; LastUpdated: 2022-06-20 13:21:27; Lifecycle Status: Active; Minimum Order: 1; Mounting Type: Surface Mount; PartId: 4; Part Status: Active; Price: 0.73; Series: WS-SLSU; Supplier 1: DigiKey; Supplier Part Number 1: 732-450405020524CT-ND; Switch Function: On-On; Termination Style: SMD (SMT) Tab
U1 = ISD1760SY: Voice Record/Playback IC Multiple Message 40 ~ 120 Sec Pushbutton, SPI 28-SOIC; Manufacturer Part Number 1: ISD1760SY; Supplier 1: Digi-Key

## Nets that join several sheets
+5V: Top-Sheet (T1.1), FrontDoorConnecteur (J1.1), Buzzer, LED (BZ1.1 D2.2 J4.4), Enregistreur et Speaker Audio (14 pins)
GND: Top-Sheet (T2.1), FrontDoorConnecteur (J1.10), Buzzer, LED (8 pins), Enregistreur et Speaker Audio (30 pins)
E/S EN: Top-Sheet (T3.1), FrontDoorConnecteur (J1.5), Enregistreur et Speaker Audio (J8.8 U1.7)
LED_B_CTRL: FrontDoorConnecteur (J1.4), Buzzer, LED (Q3.1 R3.2)
LED_G_CTRL: FrontDoorConnecteur (J1.3), Buzzer, LED (Q2.1 R2.2)
LED_R_CTRL: FrontDoorConnecteur (J1.2), Buzzer, LED (Q1.1 R1.2)
MISO: Top-Sheet (T5.1), FrontDoorConnecteur (J1.6), Enregistreur et Speaker Audio (J8.9 U1.4)
MOSI: Top-Sheet (T4.1), FrontDoorConnecteur (J1.7), Enregistreur et Speaker Audio (J8.10 U1.5)
NetJ1_8: FrontDoorConnecteur (J1.8), Buzzer, LED (Q4.1 R4.2)
SCL/CLK: Top-Sheet (T6.1), FrontDoorConnecteur (J1.9), Enregistreur et Speaker Audio (J8.11 U1.6)

## Assembly variants
TEST VERSIONS: not fitted J2 J3 J7 J8
COMPLETED TEST VERSION: not fitted J2 J3 J4 J5 J6 J7 J8